# EAGLE design USBPowerSupply (EAGLE 6.2)
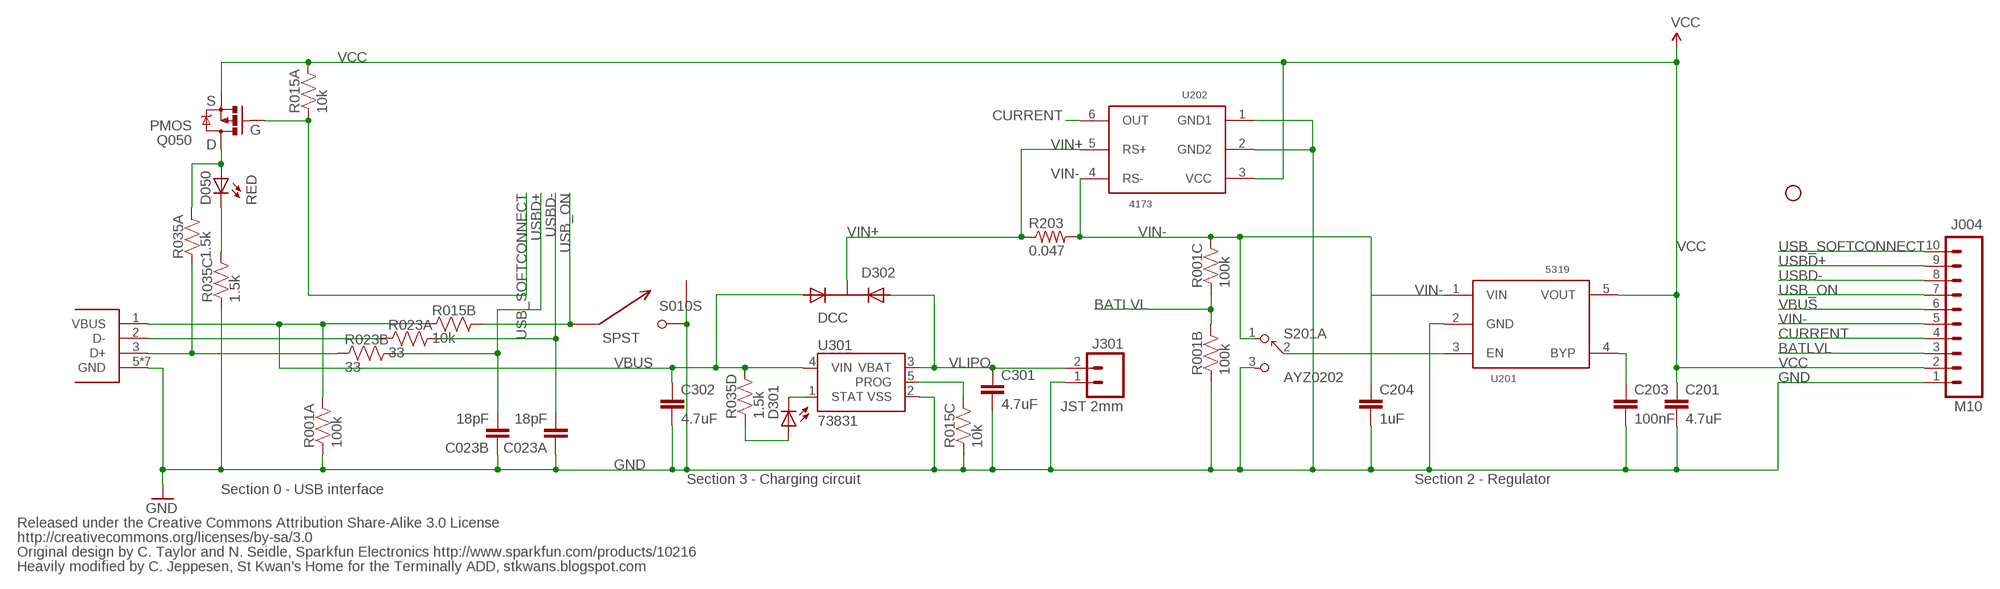
[diagram p0: schematic, sheet 1]

## Parts
C023  18pF  CKCM25  [CKCM25]
C201  4.7uF  CAP0402-CAP  [0402-CAP]
C203  100nF  CAP0402-CAP  [0402-CAP]
C204  1uF  CAP0402-CAP  [0402-CAP]
C301  4.7uF  CAP0402-CAP  [0402-CAP]
C302  4.7uF  CAP0402-CAP  [0402-CAP]
D050  RED  LED0603  [LED-0603]
D301  RED  LED0603  [LED-0603]
D302  DCC  PMEG2005CT  [SOT-23-3]
J001  USB_MICROB_JSTGCT  [USB_MICROB_3075]
J004  M10  M10"  [1X10]
J301  JST 2mm  M02-JST-2MM-SMT  [JST-2-SMD]
JP1  STAND-OFF  [STAND-OFF]
Q050  PMOS  MOSFET-PCHANNELSMD  [SOT23-3]
R001  100k  RP404  [CRA04]
R015  10k  RP404  [CRA04]
R023  33  RP2EXB24V  [CRA02]
R035  1.5k  RP404  [CRA04]
R203  0.047  RESISTOR0402-RES  [0402-RES]
S010  SPST  B3U-1100P  [B3U-1100P]
S201  AYZ0202  [AYZ0202]
U201  5319  MIC5319D5  [SOT-23-5]
U202  4173  MAX4173  [SOT-23-6]
U301  73831  MCP73831  [SOT23-5]

## Nets
BATLVL: J004.3 R001.3 R001.7
CONN_D+: J001.3(D+) R023.2 R035.1
CONN_D-: J001.2(D-) R023.1
CURRENT: J004.4 U202.6(OUT)
GND: C023.1 C023.2 C201.2 C203.2 C204.2 C301.2 C302.2 J001.5(GND) J001.P$1(GND) J001.P$2(GND) J001.P$3(GND) J001.P$4(GND) J001.P$8(GND) J001.P$10(GND) J004.1 J301.1 R001.1 R001.2 R015.3 R035.3 S010.P$2 S010.P$3 S201.3 U201.2(GND) U202.1(GND1) U202.2(GND2) U301.2(VSS)
N$1: D301.A R035.4
N$2: R015.6 U301.5(PROG)
N$3: D301.C U301.1(STAT)
N$4: S201.2 U201.3(EN)
N$6: D050.A Q050.3(D) R035.8
N$7: D050.C R035.6
N$17: C203.1 U201.4(BYP)
USB_ON: J004.7 R015.7 S010.P$1
USB_SOFTCONNECT: J004.10 Q050.1(G) R015.1
USBD+: C023.3 J004.9 R023.3
USBD-: C023.4 J004.8 R023.4
VBUS [power]: C302.1 D302.1(A1) J001.1(VBUS) J004.6 R001.8 R015.2 R035.5 U301.4(VIN)
VCC: C201.1 J004.2 Q050.2(S) R015.8 U201.5(VOUT) U202.3(VCC)
VIN+: D302.3(K) R203.1 U202.5(RS+)
VIN-: C204.1 J004.5 R001.6 R203.2 S201.1 U201.1(VIN) U202.4(RS-)
VLIPO [power]: C301.1 D302.2(A2) J301.2 U301.3(VBAT)
Unconnected: R001.4 R001.5 R015.4 R015.5 R035.2 R035.7 S201.4 S201.5 S201.6

## Notes on the sheet
- S
- G
- D
- Section 0 - USB interface | Section 3 - Charging circuit | Section 2 - Regulator
- Released under the Creative Commons Attribution Share-Alike 3.0 License
- http://creativecommons.org/licenses/by-sa/3.0
- Original design by C. Taylor and N. Seidle, Sparkfun Electronics http://www.sparkfun.com/products/10216
- Heavily modified by C. Jeppesen, St Kwan's Home for the Terminally ADD, stkwans.blogspot.com

## Library data of the parts
C023 = KwanSystems:CKC
C201 C203 C204 C301 C302 = SparkFun:CAP: Capacitor Standard 0603 ceramic capacitor, and 0.1" leaded capacitor.
D050 D301 = SparkFun:LED: LEDs Standard schematic elements and footprints for 5mm, 3mm, 1206, and 0603 sized LEDs. 5mm - Spark Fun Electronics SKU : COM-00529 (and others)
D302 = KwanSystems:PMEG2005CT
J001 = KwanSystems:USB_MICROB_JST
J004 = SparkFun:M10: Header 10 Standard 10-pin 0.1" header. Use with straight break away headers (SKU : PRT-00116), right angle break away headers (PRT-00553), swiss pins (PRT-00743), machine pins (PRT-00117), and female headers (PRT-00115).
J301 = SparkFun:M02: Header 2 Standard 2-pin 0.1" header. Use with straight break away headers (SKU : PRT-00116), right angle break away headers (PRT-00553), swiss pins (PRT-00743), machine pins (PRT-00117), and female headers (PRT-00115). Molex polarized connector foot print use with SKU : PRT-08233 with associated crimp pins and housings.
JP1 = SparkFun:STAND-OFF: Stand Off This is the mechanical footprint for a #4 phillips button head screw. Use the keepout ring to avoid running the screw head into surrounding components. SKU : PRT-00447
Q050 = SparkFun:MOSFET-PCHANNEL
R001 R015 R035 = KwanSystems:RP4
R023 = KwanSystems:RP2
R203 = SparkFun:RESISTOR: Resistor Basic schematic elements and footprints for 0603, 1206, and PTH resistors.
S010 = KwanSystems:B3U-1100P
S201 = KwanSystems:AYZ0202
U201 = KwanSystems:MIC5319
U202 = KwanSystems:MAX4173
U301 = SparkFun:MCP73831: Microchip's MCP73831 Miniature single cell, fully integrated Li-Ion, Li-polymer charge management controller http://ww1.microchip.com/downloads/en/DeviceDoc/21984a.pdf

## Net classes
0 default: width 0.152 mm, drill 0.33 mm, clearance 0.152 mm
1 power: width 0.152 mm, drill 0.33 mm, clearance 0.152 mm to class 0, clearance 0.152 mm
2 hv: width 0.152 mm, drill 0.33 mm, clearance 0.152 mm to class 0, clearance 0.152 mm to class 1, clearance 0.152 mm

## Board
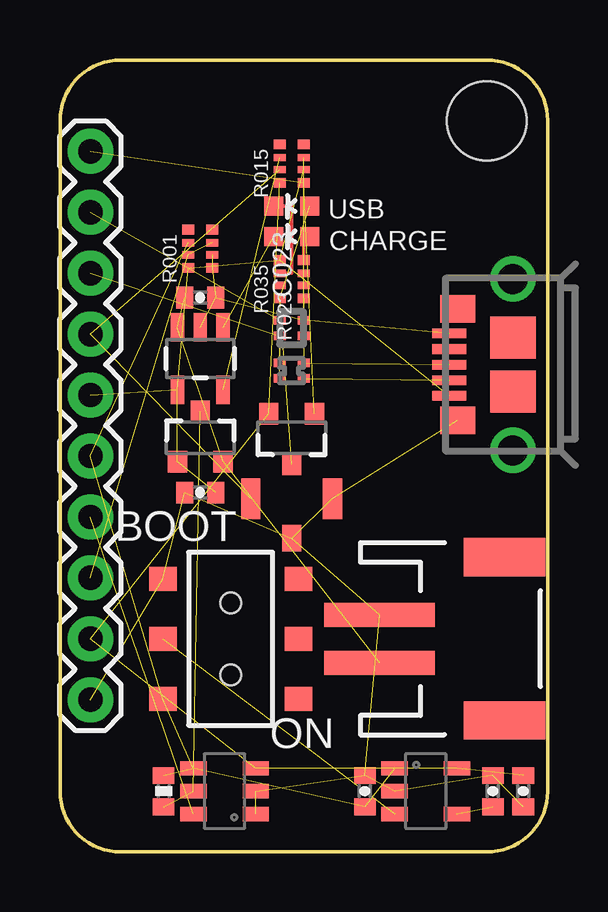
[diagram p1: board, top side]
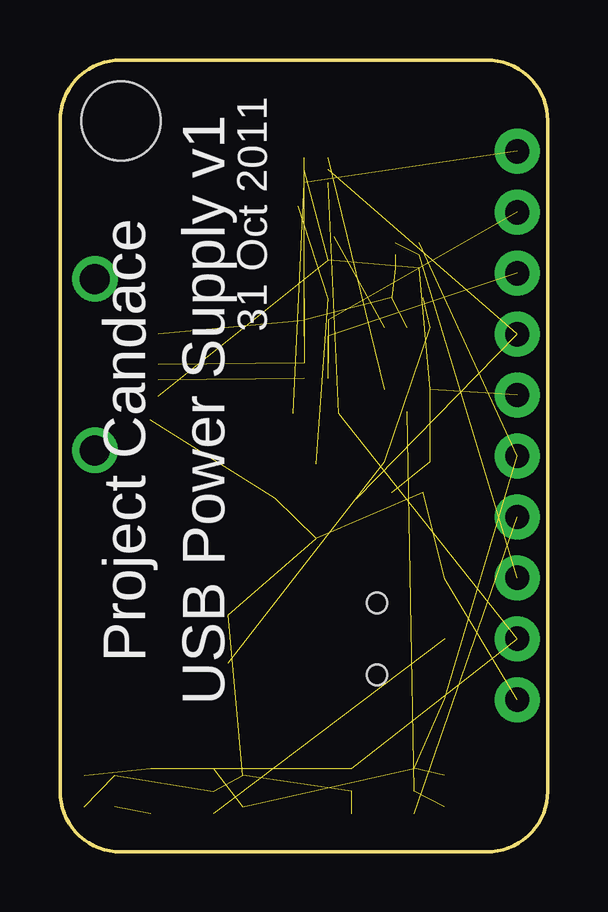
[diagram p2: board, bottom side, seen from below]

Size 20.32 x 33.02 mm. Coordinates in mm from the lower left corner, seen from the top.
Outline: 2.54,33.02 17.78,33.02 arc-90 20.32,30.48 20.32,2.54 arc-90 17.78,0 2.54,0 arc-90 0,2.54 0,30.48 arc-90 2.54,33.02
Copper layers (1*16): Top 0.0356mm / dielectric 1.5011mm / Bottom 0.0356mm
Design rules: minimum track width 6mil, minimum drill 13mil, track to track 6mil, track to pad 6mil, pad to pad 6mil, via to via 6mil, smd to smd 6mil, copper to edge 15mil, drill to drill 6mil, minimum pad ring 7mil, minimum via ring 7mil, stop-mask expansion 4mil, vias tented up to drill 14mil, thermal gap 10mil
vRestrict: area 13.5,24.9 to 14.2,25.7; area 13.5,27.4 to 13.7,27.7

### Footprints (pad centres in the part's own frame; a part is rotated, then mirrored left to right if it is on the bottom)
CKCM25 = smd 0.35 x 0.5: 1 -0.325,-0.5; 2 0.325,-0.5; 3 0.325,0.5; 4 -0.325,0.5
0402-CAP = smd 0.7 x 0.9: 1 -0.65,0; 2 0.65,0
LED-0603 = smd 0.8 x 0.8: A 0,-0.75; C 0,0.75
SOT-23-3 = smd 0.9 x 0.8: 1 -1,0.95; 2 -1,-0.95; 3 1.1,0
USB_MICROB_3075 = smd 0.4 x 1.4: 1 -1.3,4.1; 2 -0.65,4.1; 3 0,4.1; 4 0.65,4.1; 5 1.3,4.1 | smd 1.15 x 1.45: P$1 2.32,3.75; P$10 -2.32,3.75 | smd 1.75 x 1.9: P$2 1.125,1.45; P$8 -1.125,1.45 | drill 1.25 pad 1.9: P$3 -3.575,1.45; P$4 3.575,1.45
1X10 = drill 1.016 pad 1.88: 1 0,0; 2 2.54,0; 3 5.08,0; 4 7.62,0; 5 10.16,0; 6 12.7,0; 7 15.24,0; 8 17.78,0; 9 20.32,0; 10 22.86,0
JST-2-SMD = smd 1 x 4.6: 1 -1,-3.7; 2 1,-3.7 | smd 1.6 x 3.4: NC1 -3.4,1.5; NC2 3.4,1.5
STAND-OFF = hole 3.302: 0,0
SOT23-3 = smd 0.8 x 0.9: 1 -0.95,-1; 2 0.95,-1; 3 0,1.1
CRA04 = smd 0.4 x 0.5: 1 -0.8,-0.5; 4 0.8,-0.5; 5 0.8,0.5; 8 -0.8,0.5 | smd 0.3 x 0.5: 2 -0.25,-0.5; 3 0.25,-0.5; 6 0.25,0.5; 7 -0.25,0.5
CRA02 = smd 0.35 x 0.5: 1 -0.325,-0.5; 2 0.325,-0.5; 3 0.325,0.5; 4 -0.325,0.5
0402-RES = smd 0.7 x 0.9: 1 -0.65,0; 2 0.65,0
B3U-1100P = smd 0.8 x 1.7: P$1 -1.7,0; P$2 1.7,0 | smd 0.8 x 1.1: P$3 0,-1.65
AYZ0202 = smd 1 x 1.15: 1 -2.5,2.825; 2 0,2.825; 3 2.5,2.825; 4 -2.5,-2.825; 5 0,-2.825; 6 2.5,-2.825 | hole 0.85: 1.5,0; -1.5,0
SOT-23-5 = smd 0.6 x 1.1: 1 -0.95,-1.3; 2 0,-1.3; 3 0.95,-1.3; 4 0.95,1.3; 5 -0.95,1.3
SOT-23-6 = smd 0.6 x 1.1: 1 -0.95,-1.3; 2 0,-1.3; 3 0.95,-1.3; 4 0.95,1.3; 5 0,1.3; 6 -0.95,1.3
SOT23-5 = smd 0.55 x 1.2: 1 -0.95,-1.3; 2 0,-1.3; 3 0.95,-1.3; 4 0.95,1.3; 5 -0.95,1.3

### Placement (x,y rotation side)
C023  9.65,21.84 90 top
C201  19.3,2.54 270 top
C203  18.03,2.54 90 top
C204  12.7,2.54 90 top
C301  5.84,23.11 0 top
C302  5.84,14.99 180 top
D050  9.65,26.92 90 top
D301  9.65,25.65 90 top
D302  5.84,17.27 90 top
J001  20.32,20.32 90 top
J004  1.27,6.35 90 top
J301  17.02,8.89 270 top
JP1  17.78,30.48 0 top
Q050  9.65,17.27 180 top
R001  5.84,25.15 90 top
R015  9.65,28.7 90 top
R023  9.65,20.07 90 top
R035  9.65,23.88 90 top
R203  4.32,2.54 90 top
S010  9.65,14.73 0 top
S201  7.11,8.89 90 top
U201  15.24,2.54 270 top
U202  6.86,2.54 90 top
U301  5.84,20.57 180 top

### Tracks (layer width: path | path; a pad name or v marks a point on that pad's centre or on a via)
BATLVL  (2 unrouted)
CONN_D+  (2 unrouted)
CONN_D-  (1 unrouted)
CURRENT  (1 unrouted)
GND  (20 unrouted)
N$1
  Top 0.152: D301.A 10.15,25.65 R035.4
N$2  (1 unrouted)
N$3  (1 unrouted)
N$4  (1 unrouted)
N$6  (2 unrouted)
N$7
  Top 0.152: D050.C 9.65,26.92 9.65,24.13 R035.6
N$17  (1 unrouted)
USB_ON  (2 unrouted)
USB_SOFTCONNECT  (2 unrouted)
USBD+  (2 unrouted)
USBD-  (2 unrouted)
VBUS  (7 unrouted)
VCC  (5 unrouted)
VIN+  (2 unrouted)
VIN-  (6 unrouted)
VLIPO  (3 unrouted)

### Text on the board
tPlace: USB | CHARGE | BOOT | ON
bPlace: 31 Oct 2011 | USB Power Supply v1 | Project Candace
Document: Released under the Creative Commons | Attribution Share-Alike 3.0 License | http://creativecommons.org/licenses/by-sa/3.0 | Original design by C. Taylor and N. Seidle | Sparkfun Electronics http://www.sparkfun.com/products/10216 | Heavily modified by C. Jeppesen | St Kwan's Home for the Terminally ADD, stkwans.blogspot.com